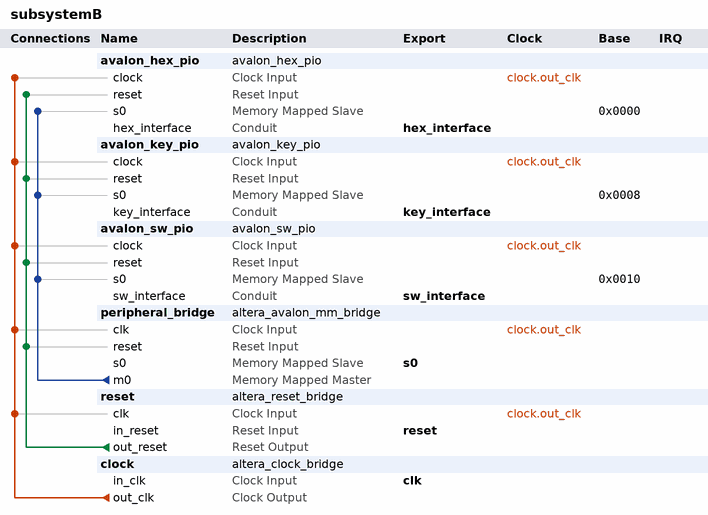
[diagram p0: system contents]
# Platform Designer (Qsys) system subsystemB, MAX 10 10M50DAF484C7G
# Parameters at their usual value, and those the tool derives, are not listed.
package require -exact qsys 18.1
create_system subsystemB
set_project_property DEVICE_FAMILY {MAX 10}
set_project_property DEVICE 10M50DAF484C7G

add_instance avalon_hex_pio avalon_hex_pio 1.0

add_instance avalon_key_pio avalon_key_pio 1.0
set_instance_parameter_value avalon_key_pio DEBOUNCE_LIMIT 1000000

add_instance avalon_sw_pio avalon_sw_pio 1.0

add_instance peripheral_bridge altera_avalon_mm_bridge 18.1
set_instance_parameter_value peripheral_bridge ADDRESS_UNITS SYMBOLS
set_instance_parameter_value peripheral_bridge ADDRESS_WIDTH 10
set_instance_parameter_value peripheral_bridge DATA_WIDTH 32
set_instance_parameter_value peripheral_bridge MAX_PENDING_RESPONSES 4
set_instance_parameter_value peripheral_bridge USE_AUTO_ADDRESS_WIDTH 0

add_instance reset altera_reset_bridge 18.1
set_instance_parameter_value reset ACTIVE_LOW_RESET 0
set_instance_parameter_value reset SYNCHRONOUS_EDGES deassert

add_instance clock altera_clock_bridge 18.1
set_instance_parameter_value clock DERIVED_CLOCK_RATE 0
set_instance_parameter_value clock EXPLICIT_CLOCK_RATE 0

# connections
add_connection clock.out_clk avalon_hex_pio.clock clock
add_connection clock.out_clk avalon_key_pio.clock clock
add_connection clock.out_clk avalon_sw_pio.clock clock
add_connection clock.out_clk peripheral_bridge.clk clock
add_connection clock.out_clk reset.clk clock
add_connection reset.out_reset avalon_hex_pio.reset reset
add_connection reset.out_reset avalon_key_pio.reset reset
add_connection reset.out_reset avalon_sw_pio.reset reset
add_connection reset.out_reset peripheral_bridge.reset reset
add_connection peripheral_bridge.m0 avalon_hex_pio.s0 avalon
set_connection_parameter_value peripheral_bridge.m0/avalon_hex_pio.s0 baseAddress 0x0000
add_connection peripheral_bridge.m0 avalon_key_pio.s0 avalon
set_connection_parameter_value peripheral_bridge.m0/avalon_key_pio.s0 baseAddress 0x0008
add_connection peripheral_bridge.m0 avalon_sw_pio.s0 avalon
set_connection_parameter_value peripheral_bridge.m0/avalon_sw_pio.s0 baseAddress 0x0010

# exported interfaces
add_interface clk clock sink
set_interface_property clk EXPORT_OF clock.in_clk
add_interface hex_interface conduit end
set_interface_property hex_interface EXPORT_OF avalon_hex_pio.hex_interface
add_interface key_interface conduit end
set_interface_property key_interface EXPORT_OF avalon_key_pio.key_interface
add_interface reset reset sink
set_interface_property reset EXPORT_OF reset.in_reset
add_interface s0 avalon slave
set_interface_property s0 EXPORT_OF peripheral_bridge.s0
add_interface sw_interface conduit end
set_interface_property sw_interface EXPORT_OF avalon_sw_pio.sw_interface

set_interconnect_requirement {$system} qsys_mm.clockCrossingAdapter HANDSHAKE
set_interconnect_requirement {$system} qsys_mm.enableEccProtection FALSE
set_interconnect_requirement {$system} qsys_mm.insertDefaultSlave FALSE
set_interconnect_requirement {$system} qsys_mm.maxAdditionalLatency 1

save_system subsystemB.qsys
